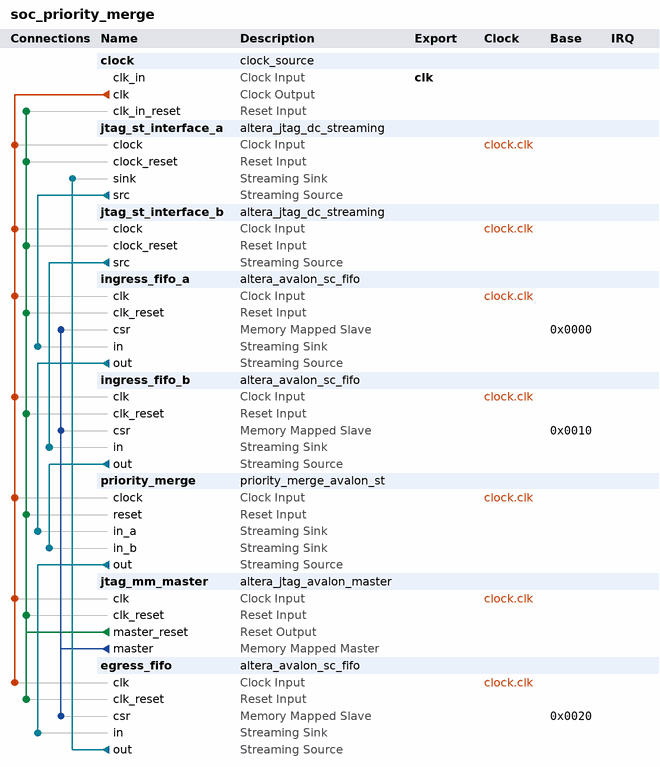
[diagram p0: system contents]
# Platform Designer (Qsys) system soc_priority_merge, Cyclone V 5CSXFC6C6U23C8ES
# Parameters at their usual value, and those the tool derives, are not listed.
package require -exact qsys 13.1
create_system soc_priority_merge
set_project_property DEVICE_FAMILY {Cyclone V}
set_project_property DEVICE 5CSXFC6C6U23C8ES

add_instance clock clock_source 13.1
set_instance_parameter_value clock clockFrequency 50000000

add_instance jtag_st_interface_a altera_jtag_dc_streaming 13.1
set_instance_parameter_value jtag_st_interface_a PURPOSE 0
set_instance_parameter_value jtag_st_interface_a UPSTREAM_FIFO_SIZE 0
set_instance_parameter_value jtag_st_interface_a DOWNSTREAM_FIFO_SIZE 0
set_instance_parameter_value jtag_st_interface_a MGMT_CHANNEL_WIDTH -1
set_instance_parameter_value jtag_st_interface_a USE_PLI 0
set_instance_parameter_value jtag_st_interface_a PLI_PORT 50000
set_instance_parameter_value jtag_st_interface_a USE_DOWNSTREAM_READY 0
set_instance_parameter_value jtag_st_interface_a COMPONENT_CLOCK 50000000
set_instance_parameter_value jtag_st_interface_a FABRIC 2.0

add_instance jtag_st_interface_b altera_jtag_dc_streaming 13.1
set_instance_parameter_value jtag_st_interface_b PURPOSE 0
set_instance_parameter_value jtag_st_interface_b UPSTREAM_FIFO_SIZE 0
set_instance_parameter_value jtag_st_interface_b DOWNSTREAM_FIFO_SIZE 0
set_instance_parameter_value jtag_st_interface_b MGMT_CHANNEL_WIDTH -1
set_instance_parameter_value jtag_st_interface_b USE_PLI 0
set_instance_parameter_value jtag_st_interface_b PLI_PORT 50000
set_instance_parameter_value jtag_st_interface_b USE_DOWNSTREAM_READY 0
set_instance_parameter_value jtag_st_interface_b COMPONENT_CLOCK 50000000
set_instance_parameter_value jtag_st_interface_b FABRIC 2.0

add_instance ingress_fifo_a altera_avalon_sc_fifo 13.1
set_instance_parameter_value ingress_fifo_a BITS_PER_SYMBOL 8
set_instance_parameter_value ingress_fifo_a FIFO_DEPTH 16
set_instance_parameter_value ingress_fifo_a CHANNEL_WIDTH 0
set_instance_parameter_value ingress_fifo_a ERROR_WIDTH 0
set_instance_parameter_value ingress_fifo_a USE_PACKETS 1
set_instance_parameter_value ingress_fifo_a USE_FILL_LEVEL 1
set_instance_parameter_value ingress_fifo_a USE_MEMORY_BLOCKS 1
set_instance_parameter_value ingress_fifo_a USE_STORE_FORWARD 0

add_instance ingress_fifo_b altera_avalon_sc_fifo 13.1
set_instance_parameter_value ingress_fifo_b BITS_PER_SYMBOL 8
set_instance_parameter_value ingress_fifo_b FIFO_DEPTH 16
set_instance_parameter_value ingress_fifo_b CHANNEL_WIDTH 0
set_instance_parameter_value ingress_fifo_b ERROR_WIDTH 0
set_instance_parameter_value ingress_fifo_b USE_PACKETS 1
set_instance_parameter_value ingress_fifo_b USE_FILL_LEVEL 1
set_instance_parameter_value ingress_fifo_b USE_MEMORY_BLOCKS 1
set_instance_parameter_value ingress_fifo_b USE_STORE_FORWARD 0

add_instance priority_merge priority_merge_avalon_st 1.0
set_instance_parameter_value priority_merge WIDTH 8

add_instance jtag_mm_master altera_jtag_avalon_master 13.1

add_instance egress_fifo altera_avalon_sc_fifo 13.1
set_instance_parameter_value egress_fifo BITS_PER_SYMBOL 8
set_instance_parameter_value egress_fifo FIFO_DEPTH 16
set_instance_parameter_value egress_fifo CHANNEL_WIDTH 0
set_instance_parameter_value egress_fifo ERROR_WIDTH 0
set_instance_parameter_value egress_fifo USE_PACKETS 1
set_instance_parameter_value egress_fifo USE_FILL_LEVEL 1
set_instance_parameter_value egress_fifo USE_MEMORY_BLOCKS 1
set_instance_parameter_value egress_fifo USE_STORE_FORWARD 0

# connections
add_connection clock.clk egress_fifo.clk clock
add_connection clock.clk ingress_fifo_a.clk clock
add_connection clock.clk ingress_fifo_b.clk clock
add_connection clock.clk jtag_mm_master.clk clock
add_connection clock.clk jtag_st_interface_a.clock clock
add_connection clock.clk jtag_st_interface_b.clock clock
add_connection clock.clk priority_merge.clock clock
add_connection jtag_mm_master.master_reset clock.clk_in_reset reset
add_connection jtag_mm_master.master_reset egress_fifo.clk_reset reset
add_connection jtag_mm_master.master_reset ingress_fifo_a.clk_reset reset
add_connection jtag_mm_master.master_reset ingress_fifo_b.clk_reset reset
add_connection jtag_mm_master.master_reset jtag_mm_master.clk_reset reset
add_connection jtag_mm_master.master_reset jtag_st_interface_a.clock_reset reset
add_connection jtag_mm_master.master_reset jtag_st_interface_b.clock_reset reset
add_connection jtag_mm_master.master_reset priority_merge.reset reset
add_connection jtag_mm_master.master egress_fifo.csr avalon
set_connection_parameter_value jtag_mm_master.master/egress_fifo.csr baseAddress 0x0020
add_connection jtag_mm_master.master ingress_fifo_a.csr avalon
set_connection_parameter_value jtag_mm_master.master/ingress_fifo_a.csr baseAddress 0x0000
add_connection jtag_mm_master.master ingress_fifo_b.csr avalon
set_connection_parameter_value jtag_mm_master.master/ingress_fifo_b.csr baseAddress 0x0010
add_connection egress_fifo.out jtag_st_interface_a.sink avalon_streaming
add_connection ingress_fifo_a.out priority_merge.in_a avalon_streaming
add_connection ingress_fifo_b.out priority_merge.in_b avalon_streaming
add_connection jtag_st_interface_a.src ingress_fifo_a.in avalon_streaming
add_connection jtag_st_interface_b.src ingress_fifo_b.in avalon_streaming
add_connection priority_merge.out egress_fifo.in avalon_streaming

# exported interfaces
add_interface clk clock sink
set_interface_property clk EXPORT_OF clock.clk_in

set_interconnect_requirement {$system} qsys_mm.clockCrossingAdapter HANDSHAKE
set_interconnect_requirement {$system} qsys_mm.maxAdditionalLatency 1
set_interconnect_requirement {$system} qsys_mm.insertDefaultSlave false

save_system soc_priority_merge.qsys
